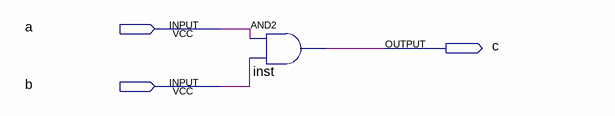
[diagram p0: schematic sheet]
// Quartus schematic and_block.bdf as structural Verilog: 1 symbols, 3 pins
module and_block (
  input  a,
  input  b,
  output c
);

  and inst (c, a, b);
endmodule
